# EAGLE schematic plantshield_huzzah_2022 (EAGLE 9.6.2)
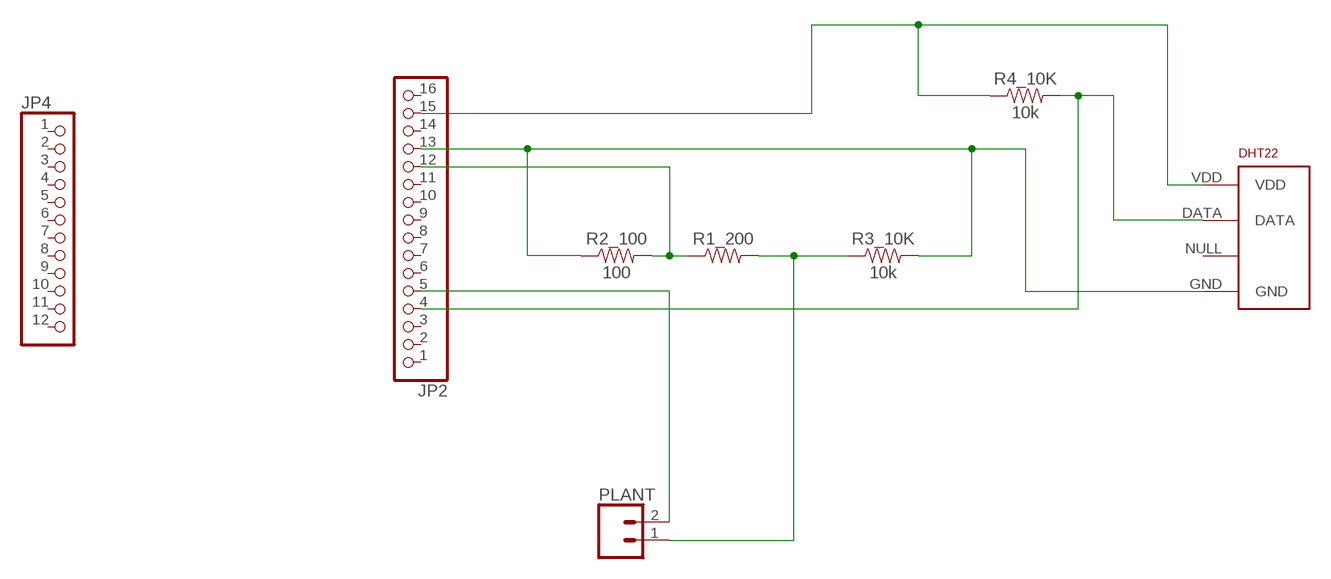
[diagram p0: schematic, sheet 1]

## Parts
DHT22  RHT03_DHT-22_AM2302  [RHT03_DHT-22]
JP2  HEADER-1X16ROUND  [1X16_ROUND]
JP4  HEADER-1X12  [1X12_ROUND]
PLANT  CONN_02  [1X02]
R1_200  RESISTORAXIAL-0.3  [AXIAL-0.3]
R2_100  100  100OHM-HORIZ-1/4W-1%  [AXIAL-0.3]
R3_10K  10k  10KOHM-HORIZ-1/4W-1%  [AXIAL-0.3]
R4_10K  10k  10KOHM-HORIZ-1/4W-1%  [AXIAL-0.3]

## Nets
N$1: JP2.5 PLANT.2
N$2: DHT22.DATA JP2.4 R4_10K.P$2
N$3: JP2.12 R1_200.P$1 R2_100.P$2
N$4: DHT22.VDD JP2.15 R4_10K.P$1
N$5: PLANT.1 R1_200.P$2 R3_10K.P$1
N$6: DHT22.GND JP2.13 R2_100.P$1 R3_10K.P$2
Unconnected: DHT22.NULL JP2.1 JP2.2 JP2.3 JP2.6 JP2.7 JP2.8 JP2.9 JP2.10 JP2.11 JP2.14 JP2.16 JP4.1 JP4.2 JP4.3 JP4.4 JP4.5 JP4.6 JP4.7 JP4.8 JP4.9 JP4.10 JP4.11 JP4.12

## Library data of the parts
DHT22 = RHT03_DHT-22_AM2302:RHT03_DHT-22_AM2302: RHT03 / DHT-22 / AM2302 Packages and symbol for the RHT03 / DHT-22 relative humidity and temperature sensor. Note: The AM2302 is a wired version of the DHT-22 which typically requires less clearance and is thus provided as a separate package.; PROD_ID: SEN-10167
JP2 = microbuilder:HEADER-1X16: PIN HEADER
JP4 = microbuilder:HEADER-1X12
PLANT = SparkFun-Connectors:CONN_02: Multi connection point. Often used as Generic Header-pin footprint for 0.1 inch spaced/style header connections On any of the 0.1 inch spaced packages, you can populate with these: Break Away Headers - Straight <https://www.sparkfun.com/products/116> (PRT-00116) Break Away Male Headers - Right Angle <https://www.sparkfun.com/products/553> (PRT-00553) Female Headers <https://www.sparkfun.com/products/115> (PRT-00115) Break Away Headers - Machine Pin <https://www.sparkfun.com/products/117> (PRT-00117) Break Away Female Headers - Swiss Machine Pin <https://www.sparkfun.com/products/743> (PRT-00743) For SCREWTERMINALS and SPRING TERMINALS visit here: Screw Terimnals on SparkFun.com <https://www.sparkfun.com/search/results?term=Screw+Terminals> (5mm/3.5mm/2.54mm spacing) This device is also useful as a general connection point to wire up your design to another part of your project. Our various solder wires solder well into these plated through hole pads. Hook-Up Wire - Assortment (Stranded, 22 AWG) <https://www.sparkfun.com/products/11375> (PRT-11375) Hook-Up Wire - Assortment (Solid Core, 22 AWG) <https://www.sparkfun.com/products/11367> (PRT-11367) View the entire wire category on our website here <https://www.sparkfun.com/categories/141> Special notes: Molex polarized connector foot print use with: PRT-08233 with associated crimp pins and housings. 2.54_SCREWTERM for use with PRT-10571. 3.5mm Screw Terminal footprints for PRT-08084 5mm Screw Terminal footprints for use with PRT-08432
R1_200 = SparkFun-Resistors:RESISTOR: Generic Resistor Package
R2_100 = SparkFun-Resistors:100OHM: 100Ω resistor A resistor is a passive two-terminal electrical component that implements electrical resistance as a circuit element. Resistors act to reduce current flow, and, at the same time, act to lower voltage levels within circuits. - Wikipedia; PROD_ID: RES-12181
R3_10K R4_10K = SparkFun-Resistors:10KOHM: 10kΩ resistor A resistor is a passive two-terminal electrical component that implements electrical resistance as a circuit element. Resistors act to reduce current flow, and, at the same time, act to lower voltage levels within circuits. - Wikipedia; PROD_ID: RES-12183